# Altium schematic sheet ETH_CON.SchDoc: ETH CON
size 420 x 297 mm; DocumentNumber: 4; SheetNumber: 13; SheetTotal: 15
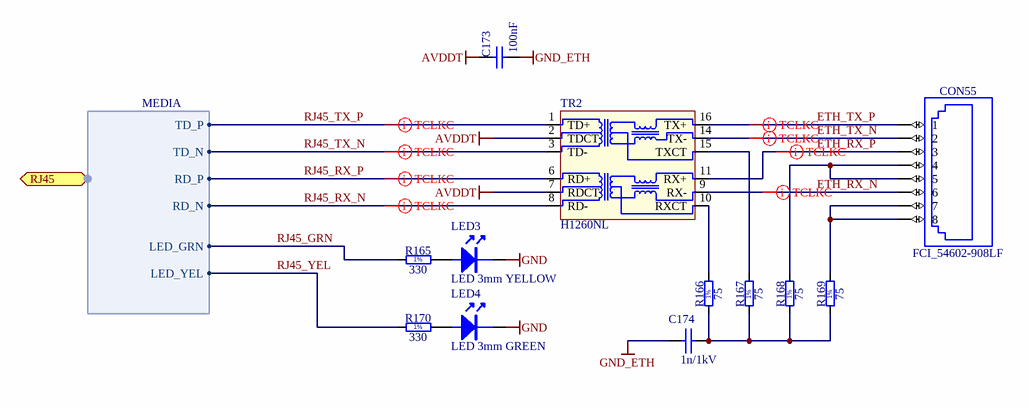
[diagram p0: ETH_CON.SchDoc]

## Parts
C173  100nF  [CAPC1005X55N]
C174  1n/1kV  [cap_ceram]
CON55  FCI_54602-908LF  [FCI_54602-908LF]
LED3  LED 3mm YELLOW  [LED]
LED4  LED 3mm GREEN  [LED]
R165  330  [RESC1608X55N]
R166  75  [RESC1608X55N]
R167  75  [RESC1608X55N]
R168  75  [RESC1608X55N]
R169  75  [RESC1608X55N]
R170  330  [RESC1608X55N]
TR2  H1260NL  [H1260NL]

## Ports
RJ45 (harness MEDIA)

## Harnesses
MEDIA: TD_P, TD_N, RD_P, RD_N, LED_GRN, LED_YEL

## Nets
AVDDT: C173.2 TR2.2(TDCT) TR2.7(RDCT)
GND: LED3.K LED4.K
GND_ETH: C173.1 C174.1
ETH_RX_N: CON55.6 TR2.9(RX-)
ETH_RX_P: CON55.3 TR2.11(RX+)
ETH_TX_N: CON55.2 TR2.14(TX-)
ETH_TX_P: CON55.1 TR2.16(TX+)
RJ45_GRN: R165.1 ; port RJ45.LED_GRN
RJ45_RX_N: TR2.8(RD-) ; port RJ45.RD_N
RJ45_RX_P: TR2.6(RD+) ; port RJ45.RD_P
RJ45_TX_N: TR2.3(TD-) ; port RJ45.TD_N
RJ45_TX_P: TR2.1(TD+) ; port RJ45.TD_P
RJ45_YEL: R170.1 ; port RJ45.LED_YEL
NetC174_2: C174.2 R166.1 R167.1 R168.1 R169.1
NetCON55_4: CON55.4 CON55.5 R168.2
NetCON55_7: CON55.7 CON55.8 R169.2
NetLED3_A: LED3.A R165.2
NetLED4_A: LED4.A R170.2
NetR166_2: R166.2 TR2.10(RXCT)
NetR167_2: R167.2 TR2.15(TXCT)

## Layout directives
differential pair: ETH_RX_N, ETH_RX_P, ETH_TX_N, ETH_TX_P, RJ45_RX_N, RJ45_RX_P, RJ45_TX_N, RJ45_TX_P

## Notes on the sheet
- Project/Equipment
- Document
- uTCA RTM 8 SFP+
- Designer
- Drawn by
- Check.by
- Copyright Creotech Instruments SA 2014.
  This documentation describes Open Hardware and is licensed under the CERN OHL v.1.1. You may redistribute and modify this documentation under the terms of the CERN OHL v.1.1. (http://ohwr.org/CERNOHL). This documentation is distributed WITHOUT ANY EXPRESS OR IMPLIED WARRANTY, INCLUDING OF MERCHANTABILITY, SATISFACTORY QUALITY AND FITNESS FOR A PARTICULAR PURPOSE. Please see the CERN OHL v.1.1 for applicable conditions.
- Creotech Instruments S.A.
- File
- Last Mod.
- Print Date
- Sheet
- Size
- A3
- of
- Rev
- (in symbol R0603_75R_1%_0.1W_100PPM) 1%
- (in symbol R0603_330R_1%_0.1W_100PPM) 1%

## Library data of the parts
C173 = CC0402_100NF_16V_10%_X7R: Non-polarised capacitor; Part Description: SMD Multilayer Chip Ceramic Capacitor; Manufacturer: GENERIC; Manufacturer1 Part Number: 223878715649; Voltage: 16V; TC: X7R; Tolerance: ±10%; Table: Capacitors SMD; Part Number: CC0402_100NF_16V_10%_X7R; Component Kind: Standard; Component Type: Standard; Pin Count: 2; Value: 100nF; Status: Not Recommended; Manufacturer Part Number: CC0402_100NF_16V_10%_X7R; Case: 0402; Mounted: Yes; Socket: No; SMD: Yes; Manufacturer1 Example: PHYCOMP; Manufacturer1 ComponentHeight: 0.55mm; HelpURL: \\cern.ch\dfs\Applications\Altium\Datasheets\CC0402_X7R_PHYCOMP.pdf; Author: CERN DEM JLC; CreateDate: 2007-12-03; LatestRevisionDate: 2007-12-03
C174 = CAP: Capacitor
CON55 = FCI_54602-908LF: 1 Port, 8 Positions, CAT3 RJ45 Horizontal Modular Jack; Manufacturer: FCI; Part Number: FCI_54602-908LF; Component Kind: Standard; Component Type: Standard; Pin Count: 8; Family: RJ45; Mounted: Yes; Socket: No; SMD: No; Status: None; Part Description: 1 Port, 8 Positions, CAT3 RJ45 Horizontal Modular Jack; Manufacturer Part Number: 54602-908LF; ComponentHeight: 10.43mm; HelpURL: \\cern.ch\dfs\Applications\Altium\Datasheets\FCI_54602-908LF.pdf; Author: CERN DEM JLC; CreateDate: 2013-01-28; LatestRevisionDate: 2013-01-28; Table: FCI
LED3 LED4 = LED
R165 R170 = R0603_330R_1%_0.1W_100PPM: Resistor - 1%; Part Description: General Purpose Thick Film Chip Resistor; Manufacturer: GENERIC; Manufacturer1 Part Number: NRC06F3300TRF; Power: 0.1W; TC: ±100ppm/°C; Table: Resistors SMD; Part Number: R0603_330R_1%_0.1W_100PPM; Component Kind: Standard; Component Type: Standard; Pin Count: 2; Value: 330; Status: Preferred; Tolerance: ±1%; Manufacturer Part Number: R0603_330R_1%_0.1W_100PPM; Case: 0603; Mounted: Yes; Socket: No; SMD: Yes; Manufacturer1 Example: NIC COMPONENT; Manufacturer1 ComponentHeight: 0.55mm; HelpURL: \\cern.ch\dfs\Applications\Altium\Datasheets\R0603_NIC_NRC.pdf; Author: CERN DEM JLC; CreateDate: 2007-12-03; LatestRevisionDate: 2008-03-13
R166-R169 = R0603_75R_1%_0.1W_100PPM: Resistor - 1%; Part Description: General Purpose Thick Film Chip Resistor; Manufacturer: GENERIC; Manufacturer1 Part Number: NRC06F75R0TRF; Power: 0.1W; TC: ±100ppm/°C; Table: Resistors SMD; Part Number: R0603_75R_1%_0.1W_100PPM; Component Kind: Standard; Component Type: Standard; Pin Count: 2; Value: 75; Status: Preferred; Tolerance: ±1%; Manufacturer Part Number: R0603_75R_1%_0.1W_100PPM; Case: 0603; Mounted: Yes; Socket: No; SMD: Yes; Manufacturer1 Example: NIC COMPONENT; Manufacturer1 ComponentHeight: 0.55mm; HelpURL: \\cern.ch\dfs\Applications\Altium\Datasheets\R0603_NIC_NRC.pdf; Author: CERN DEM JLC; CreateDate: 2007-12-03; LatestRevisionDate: 2008-03-13
TR2 = TR_H1260NL: ethernet trafo (TME)